# Altium schematic sheet Wireless.SchDoc
size A4
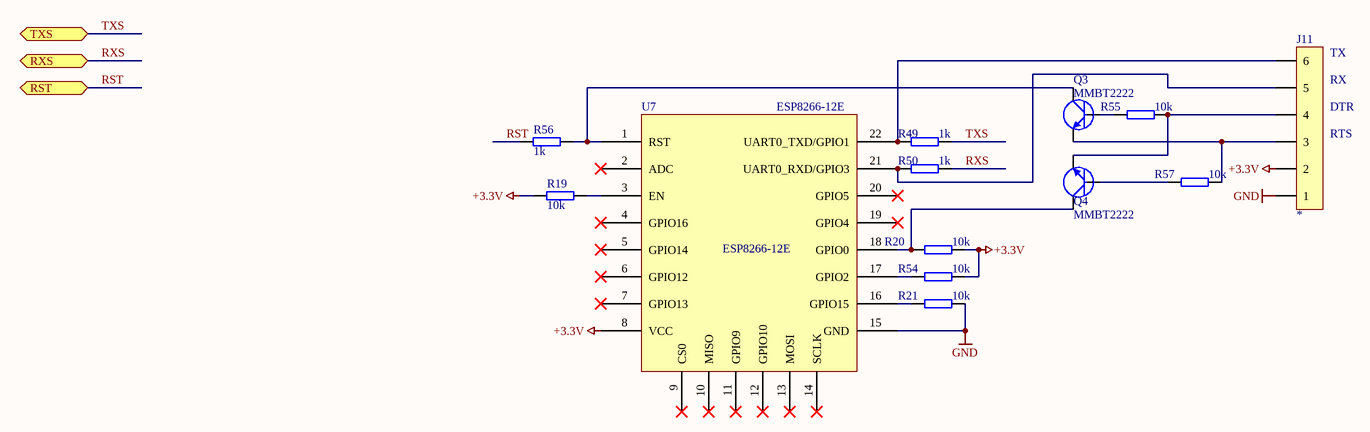
[diagram p0: Wireless.SchDoc]

## Parts
J11  *  [SIL6]
Q3  MMBT2222  [SOT23]
Q4  MMBT2222  [SOT23]
R19  10k  [RES 0805]
R20  10k  [RES 0805]
R21  10k  [RES 0805]
R49  1k  [RES 0805]
R50  1k  [RES 0805]
R54  10k  [RES 0805]
R55  10k  [RES 0805]
R56  1k  [RES 0805]
R57  10k  [RES 0805]
U7  ESP8266-12E  [ESP8266-12E]

## Ports
RST (bidir), RXS (bidir), TXS (bidir)

## Nets
+3.3V: J11.2 R19.1 R20.2 R54.2 U7.8(VCC)
GND: J11.1 R21.2 U7.15(GND)
RST: R56.1 ; port RST
RXS: R50.2 ; port RXS
TXS: R49.2 ; port TXS
NetJ11_3: J11.3 Q3.2(E) R57.2
NetJ11_4: J11.4 Q4.2(E) R55.2
NetJ11_5: J11.5 R50.1 U7.21(UART0_RXD/GPIO3)
NetJ11_6: J11.6 R49.1 U7.22(UART0_TXD/GPIO1)
NetQ3_1: Q3.1(B) R55.1
NetQ3_3: Q3.3(C) R56.2 U7.1(RST)
NetQ4_1: Q4.1(B) R57.1
NetQ4_3: Q4.3(C) R20.1 U7.18(GPIO0)
NetR19_2: R19.2 U7.3(EN)
NetR21_1: R21.1 U7.16(GPIO15)
NetR54_1: R54.1 U7.17(GPIO2)

Not connected (* = marked no-connect by the designer): U7 2(ADC)* 4(GPIO16)* 5(GPIO14)* 6(GPIO12)* 7(GPIO13)* 9(CS0)* 10(MISO)* 11(GPIO9)* 12(GPIO10)* 13(MOSI)* 14(SCLK)* 19(GPIO4)* 20(GPIO5)*

## Notes on the sheet
- (near J11) TX
- (near J11) RX
- (near J11) DTR
- (near J11) RTS

## Library data of the parts
J11 = HEADER6: 6 PIN HEADER; Value: *
Q3 Q4 = MMBT2222: NPN transistor, SO23; Name: MMBT2222; Datasheet: https://www.mouser.com/ds/2/149/MMBT2222-889752.pdf
R19-R21 R49 R50 R54-R57 = RES: RESISTOR
  R19-R21 R54 R55 R57: REFERENCE ID: *; DISTRIBUTOR: *; VALUE: 10k
  R49 R50: Reference: 81-10-99; Supplier: LOMEX; VALUE: 1k
  R56: REFERENCE ID: *; DISTRIBUTOR: *; VALUE: 1k
U7 = ESP8266-12E: WiFi module; Name: ESP8266-12E; Datasheet: https://www.elecrow.com/download/ESP-12F.pdf